# Altium schematic sheet NvideaJetsonUSB.SchDoc
size A3
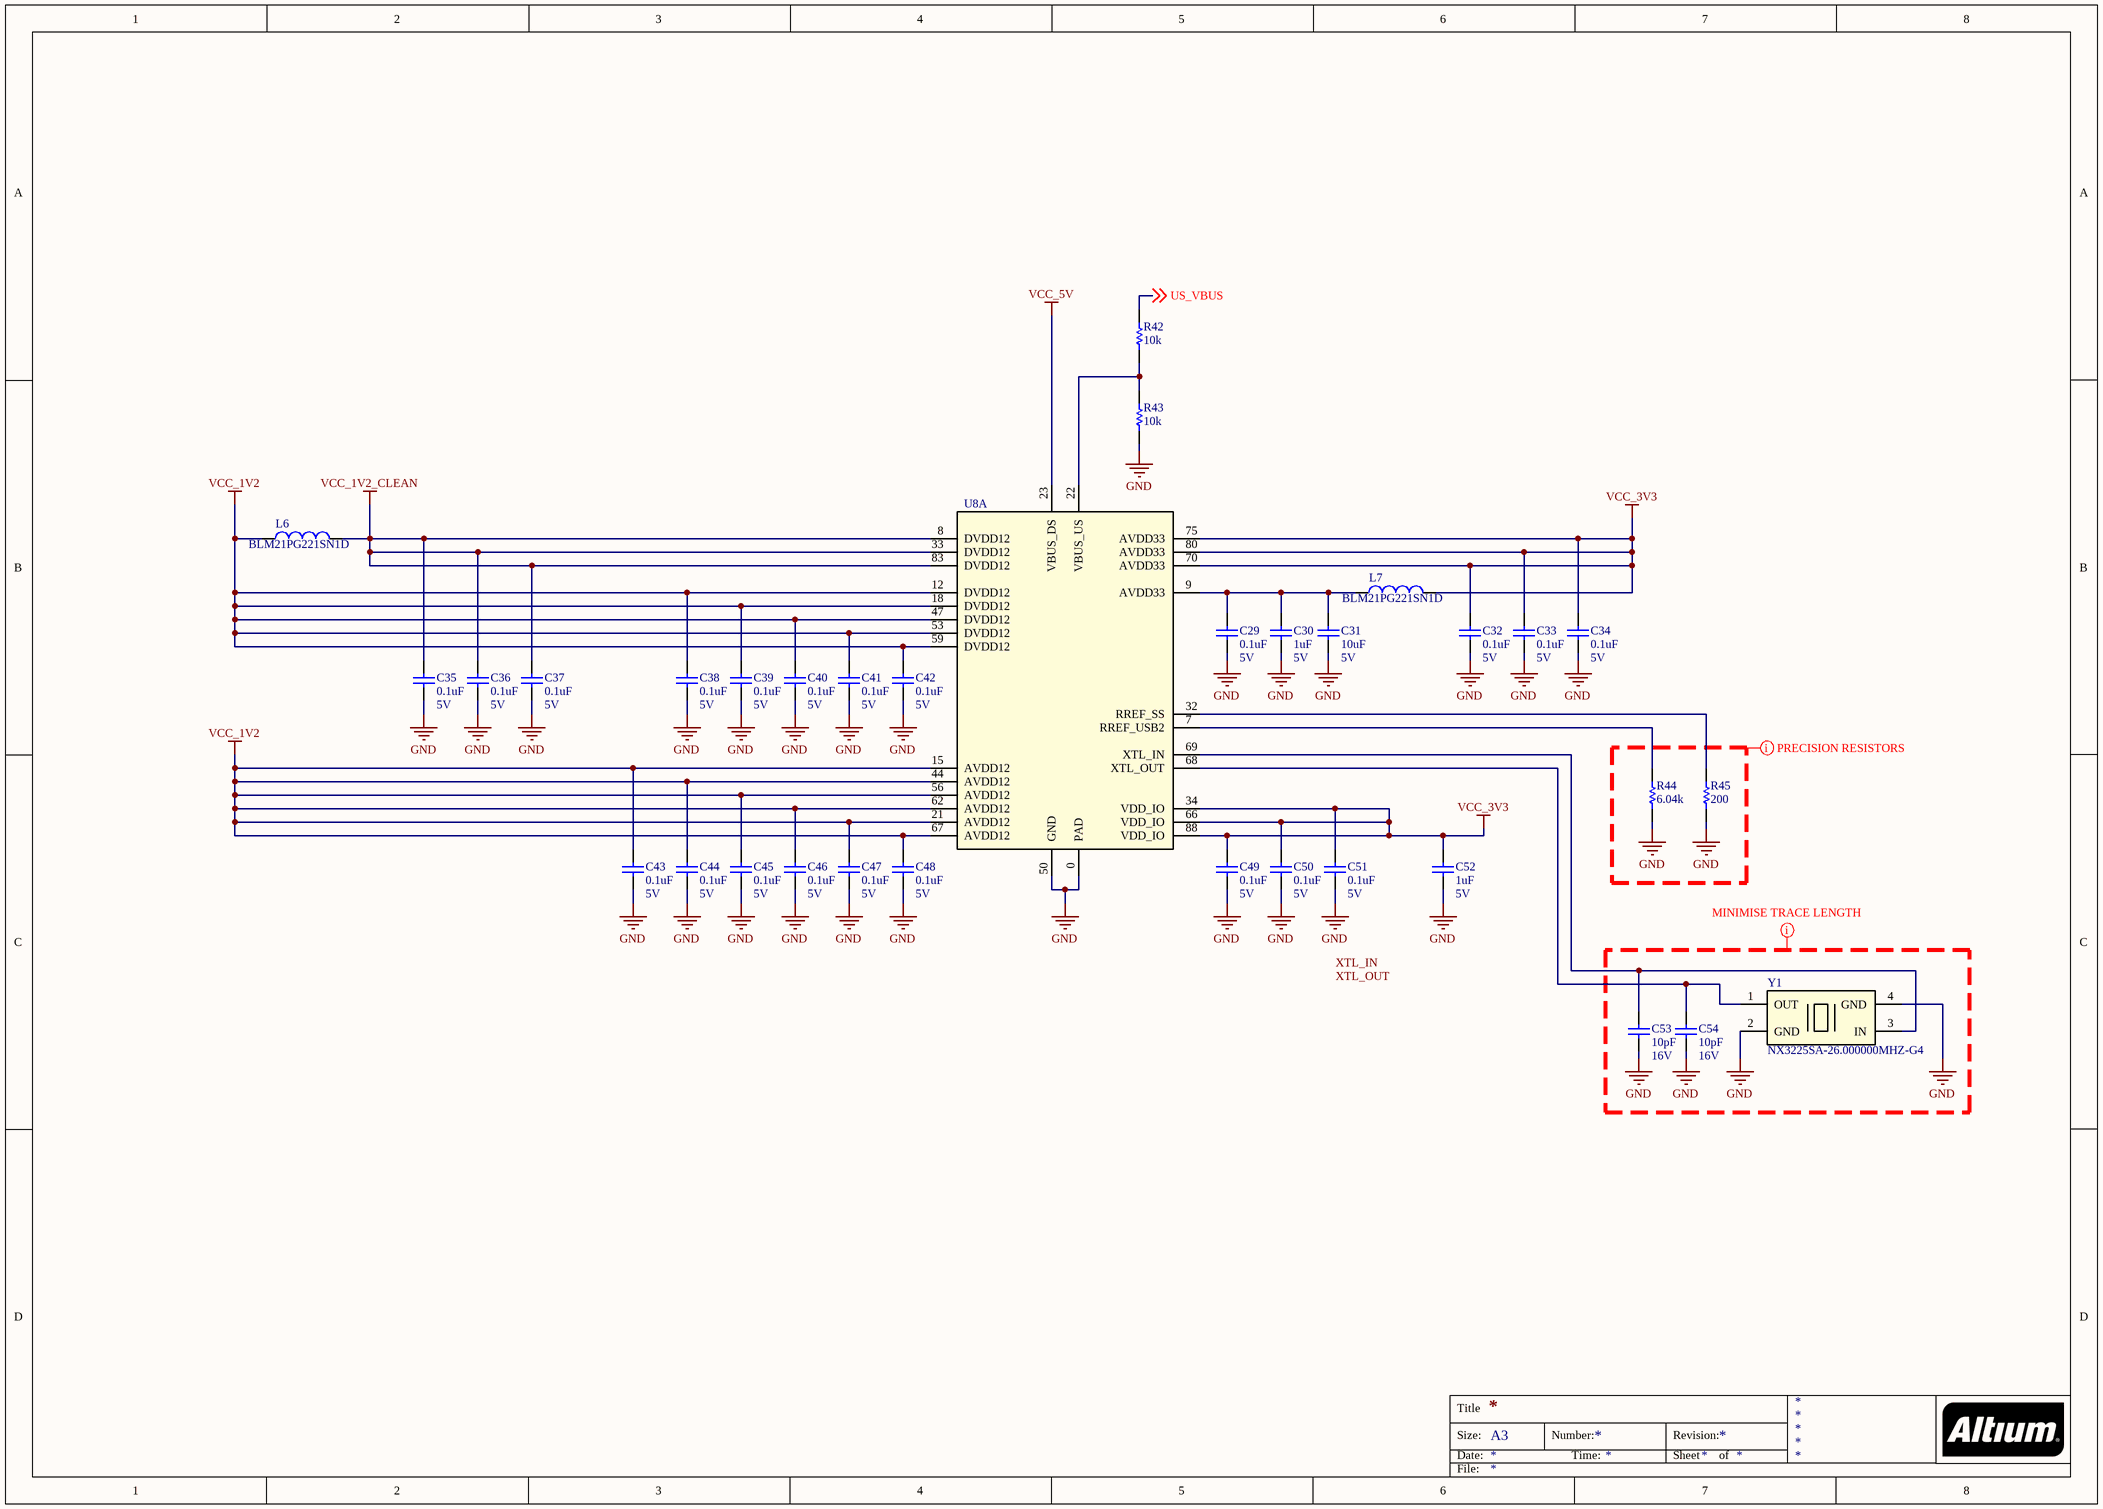
[diagram p0: NvideaJetsonUSB.SchDoc]

## Parts
C29  value 0.1uF  Voltage: 5V  [C0402]  (hidden comment: CAP)
C30  value 1uF  Voltage: 5V  [C0402]  (hidden comment: CAP)
C31  value 10uF  Voltage: 5V  [C0603]  (hidden comment: CAP)
C32  value 0.1uF  Voltage: 5V  [C0402]  (hidden comment: CAP)
C33  value 0.1uF  Voltage: 5V  [C0402]  (hidden comment: CAP)
C34  value 0.1uF  Voltage: 5V  [C0402]  (hidden comment: CAP)
C35  value 0.1uF  Voltage: 5V  [C0402]  (hidden comment: CAP)
C36  value 0.1uF  Voltage: 5V  [C0402]  (hidden comment: CAP)
C37  value 0.1uF  Voltage: 5V  [C0402]  (hidden comment: CAP)
C38  value 0.1uF  Voltage: 5V  [C0402]  (hidden comment: CAP)
C39  value 0.1uF  Voltage: 5V  [C0402]  (hidden comment: CAP)
C40  value 0.1uF  Voltage: 5V  [C0402]  (hidden comment: CAP)
C41  value 0.1uF  Voltage: 5V  [C0402]  (hidden comment: CAP)
C42  value 0.1uF  Voltage: 5V  [C0402]  (hidden comment: CAP)
C43  value 0.1uF  Voltage: 5V  [C0402]  (hidden comment: CAP)
C44  value 0.1uF  Voltage: 5V  [C0402]  (hidden comment: CAP)
C45  value 0.1uF  Voltage: 5V  [C0402]  (hidden comment: CAP)
C46  value 0.1uF  Voltage: 5V  [C0402]  (hidden comment: CAP)
C47  value 0.1uF  Voltage: 5V  [C0402]  (hidden comment: CAP)
C48  value 0.1uF  Voltage: 5V  [C0402]  (hidden comment: CAP)
C49  value 0.1uF  Voltage: 5V  [C0402]  (hidden comment: CAP)
C50  value 0.1uF  Voltage: 5V  [C0402]  (hidden comment: CAP)
C51  value 0.1uF  Voltage: 5V  [C0402]  (hidden comment: CAP)
C52  value 1uF  Voltage: 5V  [C0402]  (hidden comment: CAP)
C53  value 10pF  Voltage: 16V  [C0402]  (hidden comment: CAP)
C54  value 10pF  Voltage: 16V  [C0402]  (hidden comment: CAP)
L6  value BLM21PG221SN1D  [L0603]  (hidden comment: IND)
L7  value BLM21PG221SN1D  [L0603]  (hidden comment: IND)
R42  value 10k  [R0402]  (hidden comment: RES)
R43  value 10k  [R0402]  (hidden comment: RES)
R44  value 6.04k  [R0402]  (hidden comment: RES)
R45  value 200  [R0402]  (hidden comment: RES)
U8  CYUSB3312-88LTXC  [QFN88]  (value not drawn)  (part A of 2)
Y1  CRYSTAL  [NX3225SA-26.000000MHZ-G4]  (value not drawn)

## Nets
GND: C29.2 C30.2 C31.2 C32.2 C33.2 C34.2 C35.2 C36.2 C37.2 C38.2 C39.2 C40.2 C41.2 C42.2 C43.2 C44.2 C45.2 C46.2 C47.2 C48.2 C49.2 C50.2 C51.2 C52.2 C53.2 C54.2 R43.2 R44.2 R45.1 U8.0(PAD) U8.50(GND) Y1.2(GND) Y1.4(GND)
VCC_1V2: C38.1 C39.1 C40.1 C41.1 C42.1 C43.1 C44.1 C45.1 C46.1 C47.1 C48.1 L6.1 U8.12(DVDD12) U8.15(AVDD12) U8.18(DVDD12) U8.21(AVDD12) U8.44(AVDD12) U8.47(DVDD12) U8.53(DVDD12) U8.56(AVDD12) U8.59(DVDD12) U8.62(AVDD12) U8.67(AVDD12)
VCC_1V2_CLEAN: C35.1 C36.1 C37.1 L6.2 U8.8(DVDD12) U8.33(DVDD12) U8.83(DVDD12)
VCC_3V3: C32.1 C33.1 C34.1 C49.1 C50.1 C51.1 C52.1 L7.2 U8.34(VDD_IO) U8.66(VDD_IO) U8.70(AVDD33) U8.75(AVDD33) U8.80(AVDD33) U8.88(VDD_IO)
VCC_5V: U8.23(VBUS_DS)
US_VBUS: R42.1 ; off-sheet US_VBUS
NetC29_1: C29.1 C30.1 C31.1 L7.1 U8.9(AVDD33)
NetC53_1: C53.1 U8.69(XTL_IN) Y1.3(IN)
NetC54_1: C54.1 U8.68(XTL_OUT) Y1.1(OUT)
NetR42_2: R42.2 R43.1 U8.22(VBUS_US)
NetR44_1: R44.1 U8.7(RREF_USB2)
NetR45_2: R45.2 U8.32(RREF_SS)

## Layout directives
mark named MINIMISE TRACE LENGTH: (no net found under the mark)
mark named PRECISION RESISTORS: (no net found under the mark)

## Notes on the sheet
- Labels drawn without touching a wire or pin: XTL_IN, XTL_OUT
- Title
- Size:
- Date:
- A3
- Number:
- Time:
- Revision:
- Sheet
- of
- File:

## Library data of the parts
C29-C54 = CAP: =Description
L6 L7 = IND: BLM21PG221SN1D Ferrite Bead
R42-R45 = RES: =Description
U8 = CYUSB3312-88LTXC: USB3.0 Hub; Centerline_Pitch: .5 mm[.0197 in]; MP: 2309411-2; Number_of_Positions: 260; MF: TE Connectivity; Product_Type: Socket; SnapEDA_Link: https://www.snapeda.com/parts/2309411-2/TE%20Connectivity/view-part/?ref=snap; TE_purchase_URL: https://www.te.com/usa-en/product-2309411-2.html?te_bu=Cor&te_type=disp&te_campaign=seda_glo_cor-seda-global-disp-prtnr-fy19-seda-model-bom-cta_sma-317_1&elqCampaignId=32493; Package: None; EU_RoHS_Compliance: Compliant; Price: None; Value: *
Y1 = CRYSTAL: PART_NO.: NX3225SA-26.000000MHZ-G4